# EAGLE design icyradio-exp-fan (EAGLE 9.6.2)
CREVISION: 1; DESIGNER: Joao Silva
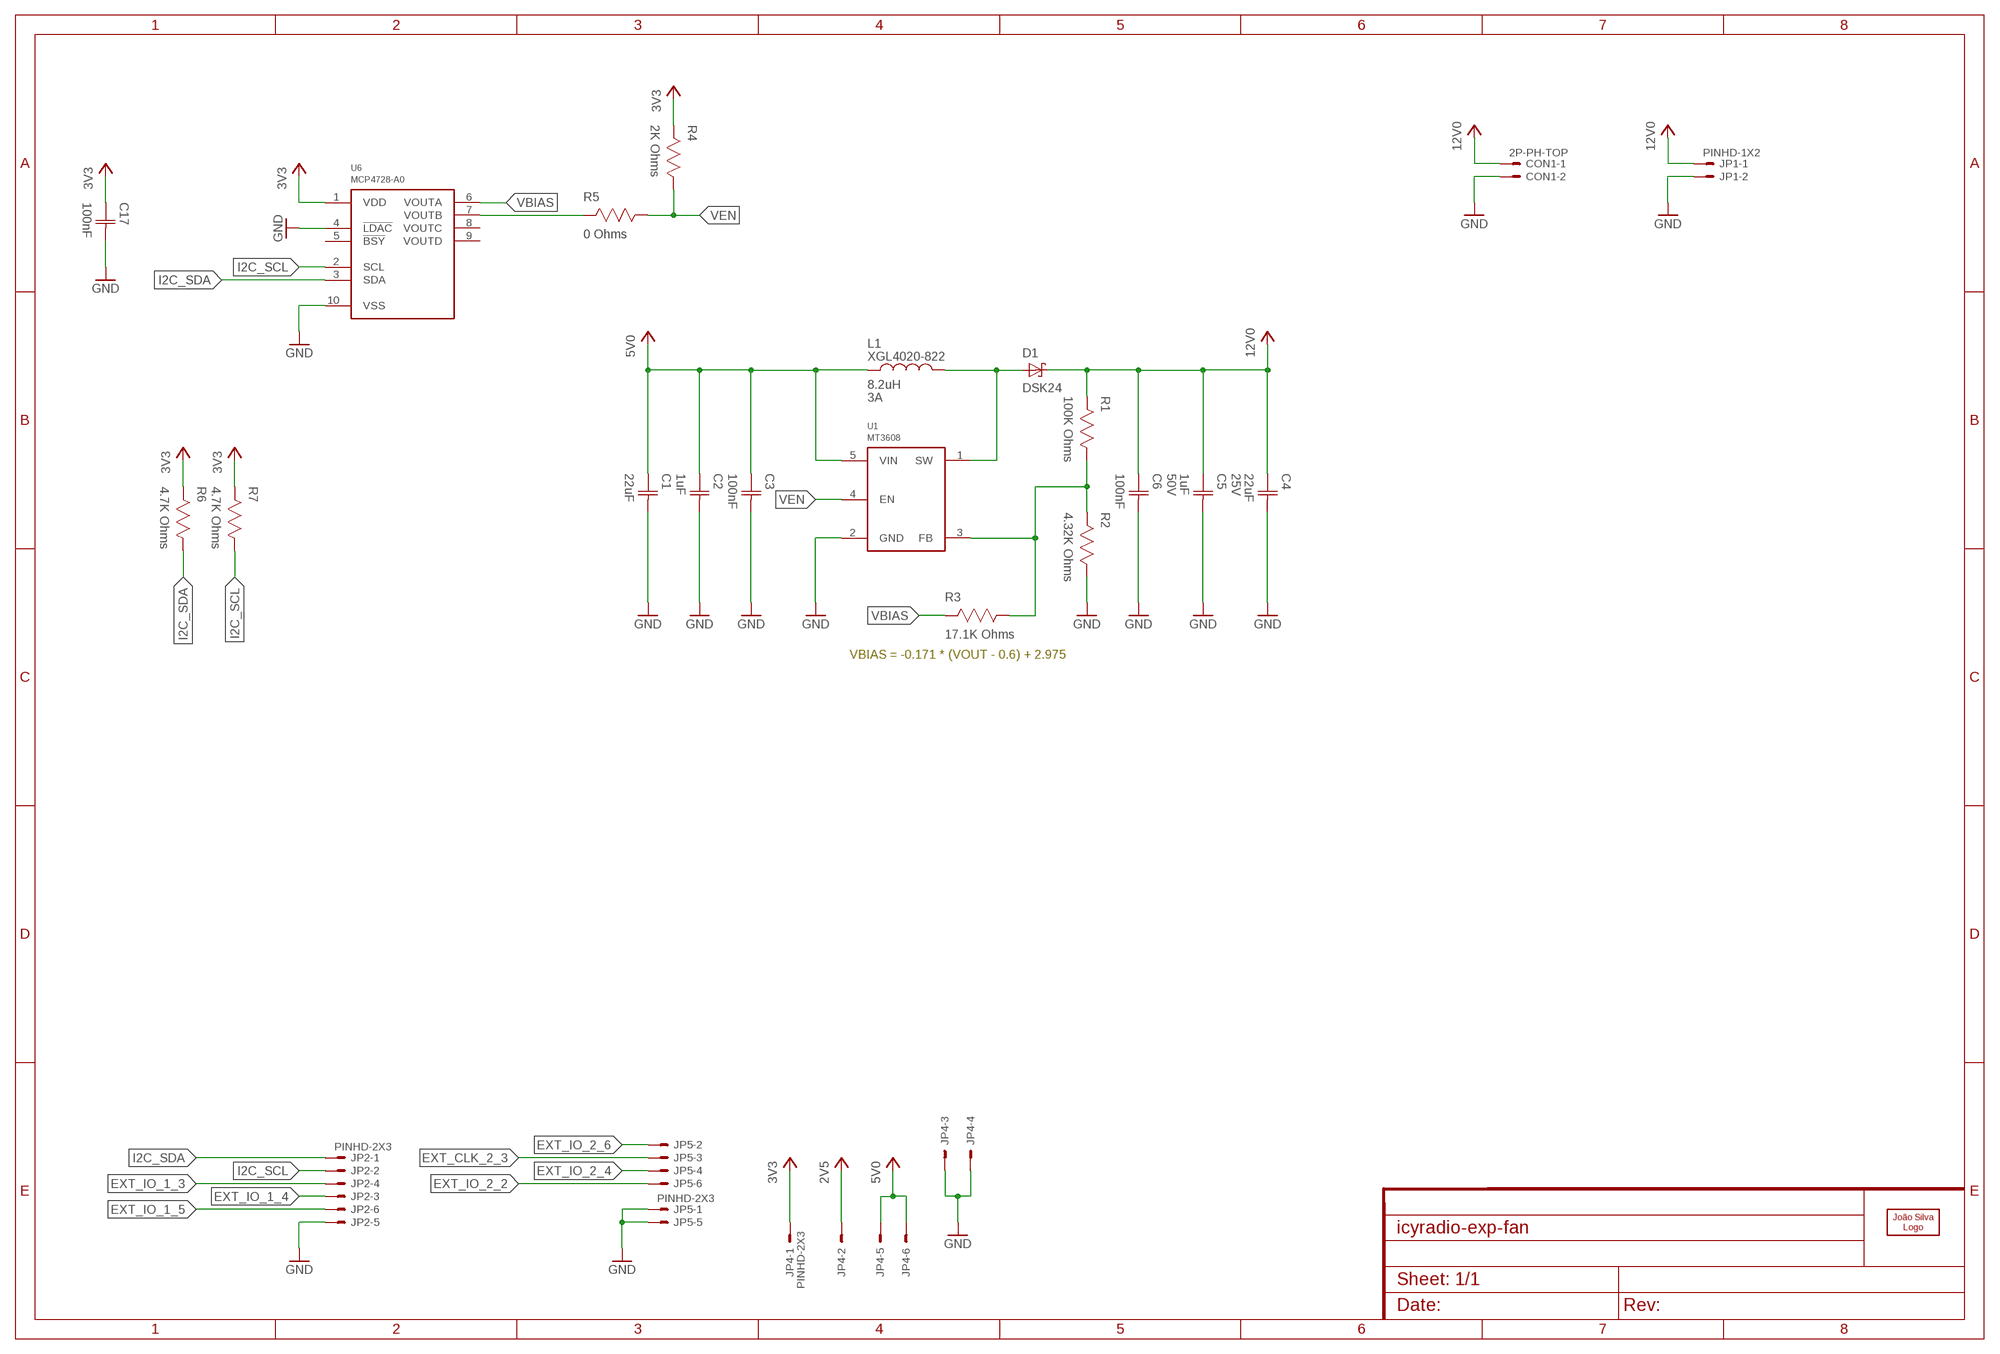
[diagram p0: schematic, sheet 1]

## Parts
C1  22uF  CAPACITOR-1206  [CAP1206]
C2  1uF  CAPACITOR-0402  [CAP0402]
C3  100nF  CAPACITOR-0402  [CAP0402]
C4  22uF  CAPACITOR-1206  [CAP1206]
C5  1uF  CAPACITOR-0402  [CAP0402]
C6  100nF  CAPACITOR-0402  [CAP0402]
C17  100nF  CAPACITOR-0402  [CAP0402]
CON1  2P-PH-TOP  [PH-02-TOP]
D1  DSK24  [SOD-123F]
JP1  PINHD-1X2  [1X02]
JP2  PINHD-2X3  [2X03]
JP4  PINHD-2X3  [2X03]
JP5  PINHD-2X3  [2X03]
L1  8.2uH  XGL4020-822  [XGL4020]
LOGO1  JSILVA-10MM  [JSILVA_10MM]
R1  100K Ohms  RESISTOR-0402  [RES0402]
R2  4.32K Ohms  RESISTOR-0402  [RES0402]
R3  17.1K Ohms  RESISTOR-0402  [RES0402]
R4  2K Ohms  RESISTOR-0402  [RES0402]
R5  0 Ohms  RESISTOR-0402  [RES0402]
R6  4.7K Ohms  RESISTOR-0402  [RES0402]
R7  4.7K Ohms  RESISTOR-0402  [RES0402]
U1  MT3608  [SOT23-6]
U6  MCP4728-A0  [MSOP10]

## Nets
2V5: JP4.2
3V3: C17.1(C1) JP4.1 R4.2 R6.2 R7.2 U6.1(VDD)
5V0: C1.1(C1) C2.1(C1) C3.1(C1) JP4.5 JP4.6 L1.1 U1.5(VIN)
12V0: C4.1(C1) C5.1(C1) C6.1(C1) CON1.1 D1.C JP1.1 R1.2
EXT_CLK_2_3 [CPWG 50 Ohm Single-Ended]: JP5.3
EXT_IO_1_3: JP2.4
EXT_IO_1_4: JP2.3
EXT_IO_1_5: JP2.6
EXT_IO_2_2: JP5.6
EXT_IO_2_4: JP5.4
EXT_IO_2_6: JP5.2
FB: R1.1 R2.2 R3.1 U1.3(FB)
GND: C1.2(C2) C2.2(C2) C3.2(C2) C4.2(C2) C5.2(C2) C6.2(C2) C17.2(C2) CON1.2 JP1.2 JP2.5 JP4.3 JP4.4 JP5.1 JP5.5 R2.1 U1.2(GND) U6.4(!LDAC) U6.10(VSS)
I2C_SCL: JP2.2 R7.1 U6.2(SCL)
I2C_SDA: JP2.1 R6.1 U6.3(SDA)
SW: D1.A L1.2 U1.1(SW)
VBIAS: R3.2 U6.6(VOUTA)
VDAC_EN: R5.2 U6.7(VOUTB)
VEN: R4.1 R5.1 U1.4(EN)
Unconnected: U6.5(!BSY) U6.8(VOUTC) U6.9(VOUTD)

## Notes on the sheet
- VBIAS = -0.171 * (VOUT - 0.6) + 2.975

## Library data of the parts
C1-C3 C6 C17 = Capacitor:CAPACITOR
C4 = Capacitor:CAPACITOR; VOLTAGE: 25V
C5 = Capacitor:CAPACITOR; VOLTAGE: 50V
CON1 = JST:2P: Disconnectable Crimp style connector, 1.0mm pitch 2 contacts
D1 = Generic Diode:DSK24
JP1 = Pin Header:PINHD-1X2: PIN HEADER
JP2 JP4 JP5 = Pin Header:PINHD-2X3: PIN HEADER
L1 = Coilcraft:XGL4020-; CURRENT: 3A; REF: XGL4020-822
LOGO1 = Silkscreen:JS
R1-R7 = Resistor:RESISTOR
U1 = Aerosemi:MT3608
U6 = Microchip:MCP4728-A*

## Net classes
1 CPWG 50 Ohm Single-Ended: width 0.2 mm, clearance 0.127 mm to class 0, clearance 0.127 mm

## Board
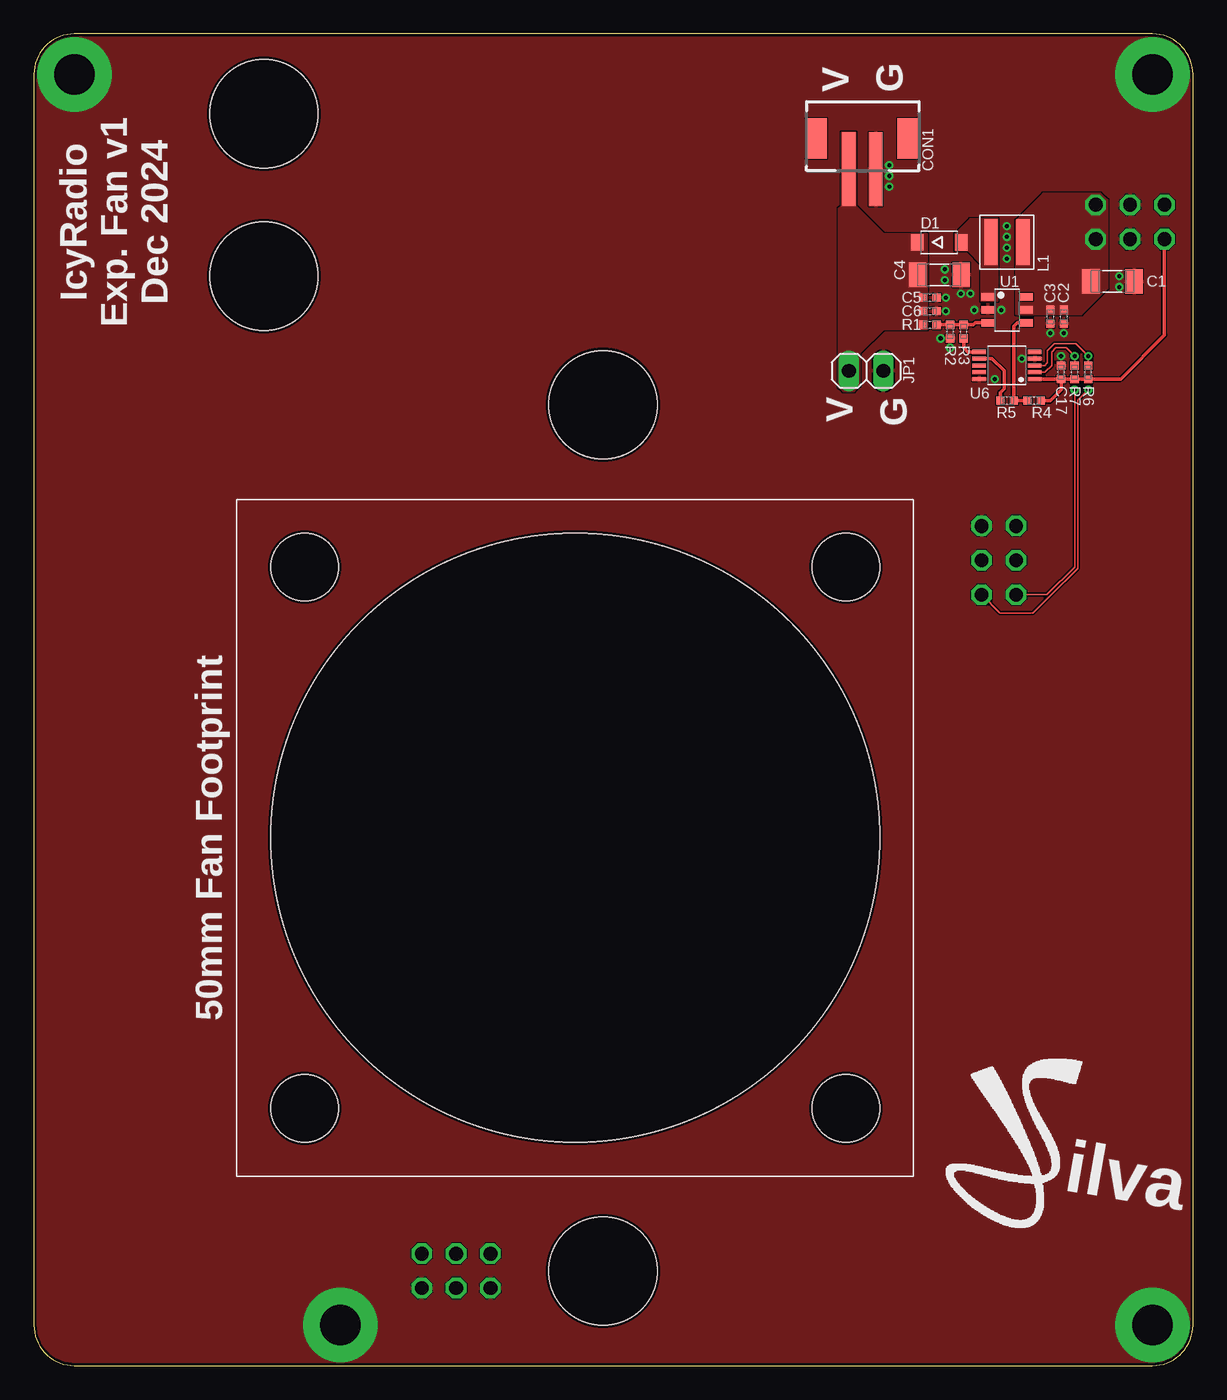
[diagram p1: board, top side]
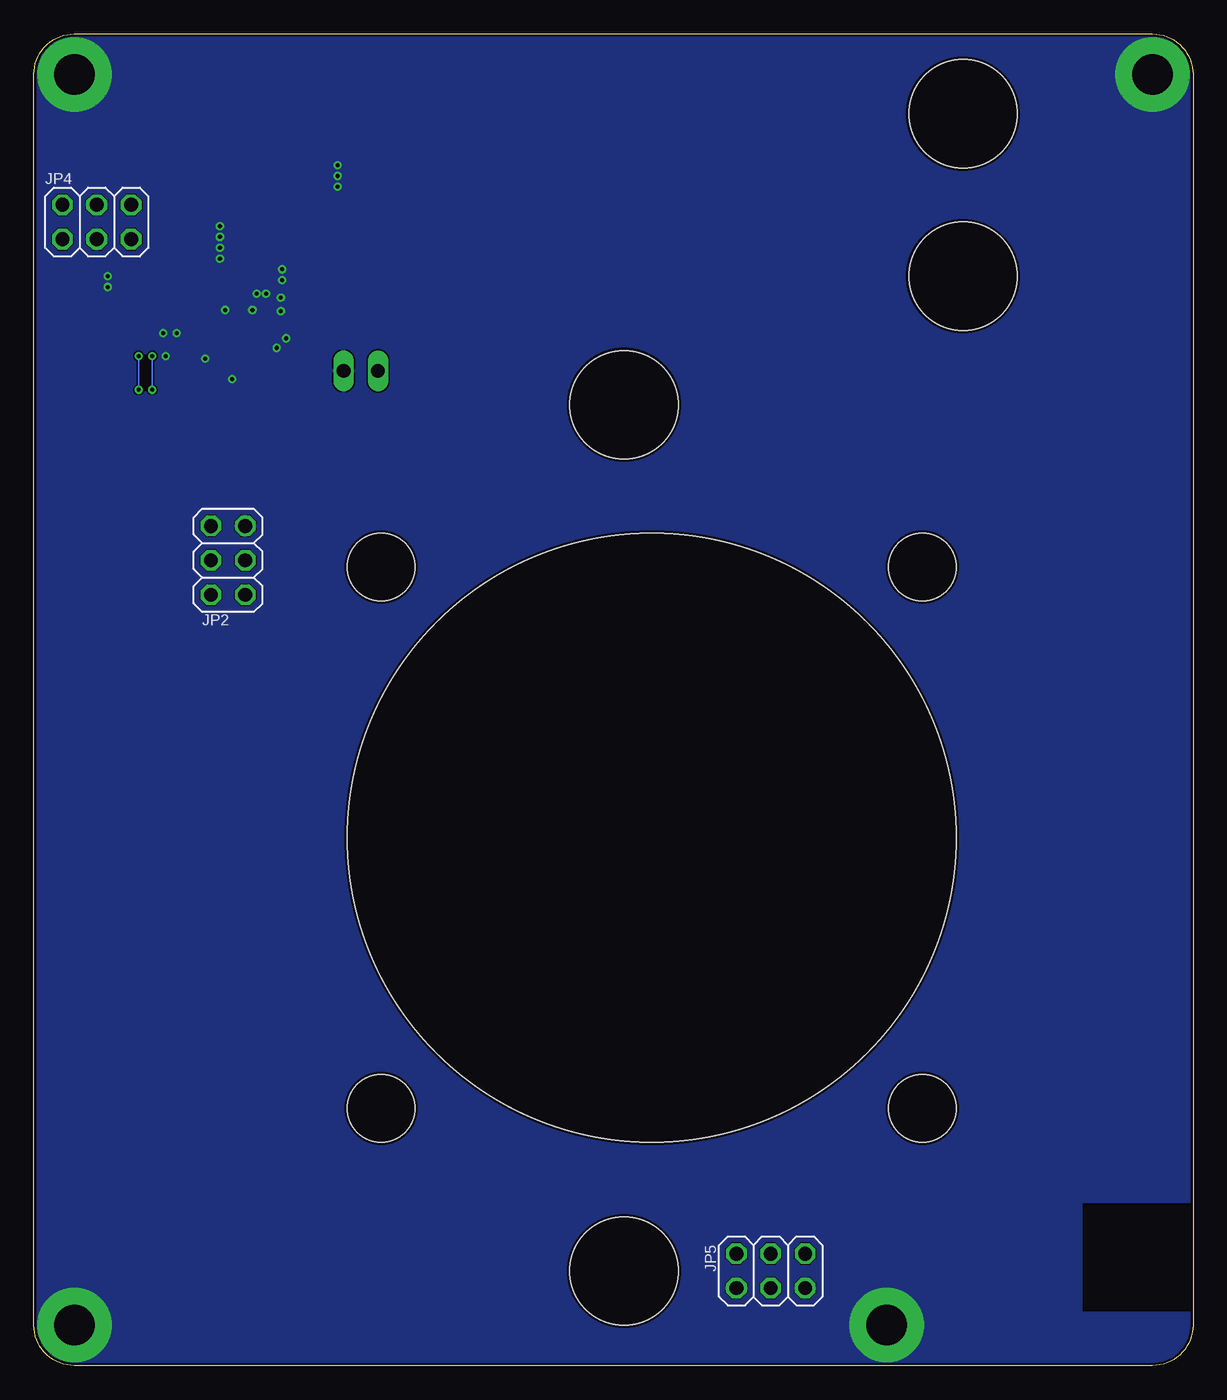
[diagram p2: board, bottom side, seen from below]

Size 85.65 x 98.4 mm. Coordinates in mm from the lower left corner, seen from the top.
Outline: 0,95.4 0,3 arc90 3,0 82.65,0 arc90 85.65,3 85.65,95.4 arc90 82.65,98.4 3,98.4 arc90 0,95.4
Copper layers (1*16): Top 0.035mm / dielectric 1.6mm / Bottom 0.035mm
Design rules "jlcpcb_2layer": minimum track width 0.1mm, minimum drill 0.3mm, track to track 0.1mm, track to pad 0.1mm, pad to pad 0.15mm, via to via 0.1mm, smd to smd 0mil, copper to edge 0.2mm, drill to drill 0.2mm, minimum pad ring 0.075mm, minimum via ring 0.075mm, stop-mask expansion 0.04mm, vias tented up to drill 10mm, thermal gap 0.1mm
Holes 8 mm at 42.05,71 17,80.5 17,92.5 42.05,7
Holes 45 mm at 40,39
Holes 5 mm at 20,59 60,59 60,19 20,19
bRestrict: area 0,4 to 8.2,12

### Footprints (pad centres in the part's own frame; a part is rotated, then mirrored left to right if it is on the bottom)
CAP1206 = smd 1.3 x 1.8: 1 -1.6,0; 2 1.6,0
CAP0402 = smd 0.6 x 0.6: 1 -0.5,0; 2 0.5,0
PH-02-TOP = smd 1 x 5.5: 1 -1,-2; 2 1,-2 | smd 1.6 x 3: P$1 -3.4,0.27; P$2 3.4,0.27
SOD-123F = smd 0.91 x 1.22: A 1.637,0; C -1.637,0
1X02 = drill 1.016 long: 1 -1.27,0; 2 1.27,0
2X03 = drill 1.016 octagon: 1 -2.54,-1.27; 2 -2.54,1.27; 3 0,-1.27; 4 0,1.27; 5 2.54,-1.27; 6 2.54,1.27
XGL4020 = smd 0.98 x 3.4: 1 -1.185,0; 2 1.185,0
RES0402 = smd 0.6 x 0.6: 1 -0.5,0; 2 0.5,0
SOT23-6 = smd 1 x 0.55: 1 -1.4,0.95; 2 -1.4,0; 3 -1.4,-0.95; 4 1.4,-0.95; 5 1.4,0; 6 1.4,0.95
MSOP10 = smd 0.3 x 1: 1 -1,-2.05; 2 -0.5,-2.05; 3 0,-2.05; 4 0.5,-2.05; 5 1,-2.05; 6 1,2.05; 7 0.5,2.05; 8 0,2.05; 9 -0.5,2.05; 10 -1,2.05

### Placement (x,y rotation side)
C1  79.7,80.1 0 top
C2  76.1,77.5 270 top
C3  75.1,77.5 270 top
C4  66.9,80.6 0 top
C5  66.2,78.9 0 top
C6  66.2,77.9 0 top
C17  75.9,73.4 90 top
CON1  61.2,90.4 0 top
D1  66.9,83 0 top
JP1  61.5,73.5 0 top
JP2  71.3,59.5 90 bottom
JP4  81,84.5 0 bottom
JP5  31.2,7 0 bottom
L1  71.9,83 180 top
LOGO1  78.4,23.2 0 top
R1  66.2,76.9 180 top
R2  67.7,76.4 90 top
R3  68.7,76.4 270 top
R4  73.9,71.3 0 top
R5  71.9,71.3 180 top
R6  77.9,73.4 270 top
R7  76.9,73.4 270 top
U1  71.9,78 0 top
U6  71.9,73.9 90 top

### Tracks (layer width: path | path; a pad name or v marks a point on that pad's centre or on a via)
3V3
  Top 0.254: U6.1 C17.1 | R4.2 75.1,71.3 75.9,72.1 C17.1 | JP4.1 83.54,76.14 80.3,72.9 R6.2 R7.2 C17.1
5V0
  pour Top (no thermals): 78.8,86.6 74.6,86.6 72.6,84.6 72.6,77.7 77.4,77.7 79.3,79.6 79.3,86.1
12V0
  pour Top (no thermals): 62.8,83.6 66,83.6 66,76.6 62.8,76.6 61,74.8 61,72.4 60.6,72 59.8,72 59.5,72.3 59.5,85.5 59.7,85.7 59.7,91.1 60.7,91.1 60.7,85.7
FB
  Top 0.254: U1.3 69.55,77.05 69.4,76.9 R3.1 R2.2 R1.1
GND  (via drill 0.3, 3 pad 5.5)
  other vias: 82.65,3 82.65,95.4 3,95.4 22.65,3 67.4,77.9 67.4,78.9 67.3,80.2 67.3,81 68.5,79.2 69.2,79.2 69.5,78 71.5,78 76.1,76.3 75.1,76.3 80.2,80.5 80.2,79.7 71,72.9 67.7,75.2 67,75.9 75.9,74.6 63.2,87.1 63.2,87.9 63.2,88.7 71.9,81.8 71.9,82.6 71.9,83.4 71.9,84.2 73,74.4
  pour Bottom (rank 6): -1.9,100.4 87.65,100.4 87.65,-2 -1.9,-2
  pour Top (rank 6): -1,99.4 86.65,99.4 86.65,-1 -1,-1
I2C_SCL  (via drill 0.3)
  Top 0.127: R7.1 v76.9,74.6 76.3,75.2 75.5,75.2 75.2,74.9 75.2,73.9 74.7,73.4 U6.2 | JP2.2 74.86,56.96 76.9,59 v76.9,72.1
  Bottom 0.127: v76.9,74.6 v76.9,72.1
I2C_SDA  (via drill 0.3)
  Top 0.127: U6.3 74.7,73.9 74.9,74.1 74.9,75 75.4,75.5 77,75.5 v77.9,74.6 R6.1 | JP2.1 71.39,55.6 73.82,55.6 75.01,56.79 75.11,56.89 77.13,58.91 77.13,71.33 v77.9,72.1
  Bottom 0.127: v77.9,74.6 v77.9,72.1
SW
  pour Top (no thermals): 70,78.7 70,81.4 69,82.4 68.1,82.4 68.1,83.6 69.2,84.7 71.2,84.7 71.2,78.7
VBIAS
  Top 0.254: U6.6 69,74.9 68.7,75.2 R3.2
VDAC_EN
  Top 0.254: R5.2 71.4,71.9 71.7,72.2 71.7,73.5 70.8,74.4 U6.7
VEN
  Top 0.254: R4.1 R5.1 72.4,76.8 72.65,77.05 U1.4

### Text on the board
tPlace: V / G | IcyRadio / Exp. Fan v1 / Dec 2024 | V / G | 50mm Fan Footprint